# EAGLE design RH017.1 (EAGLE 7.1.0)
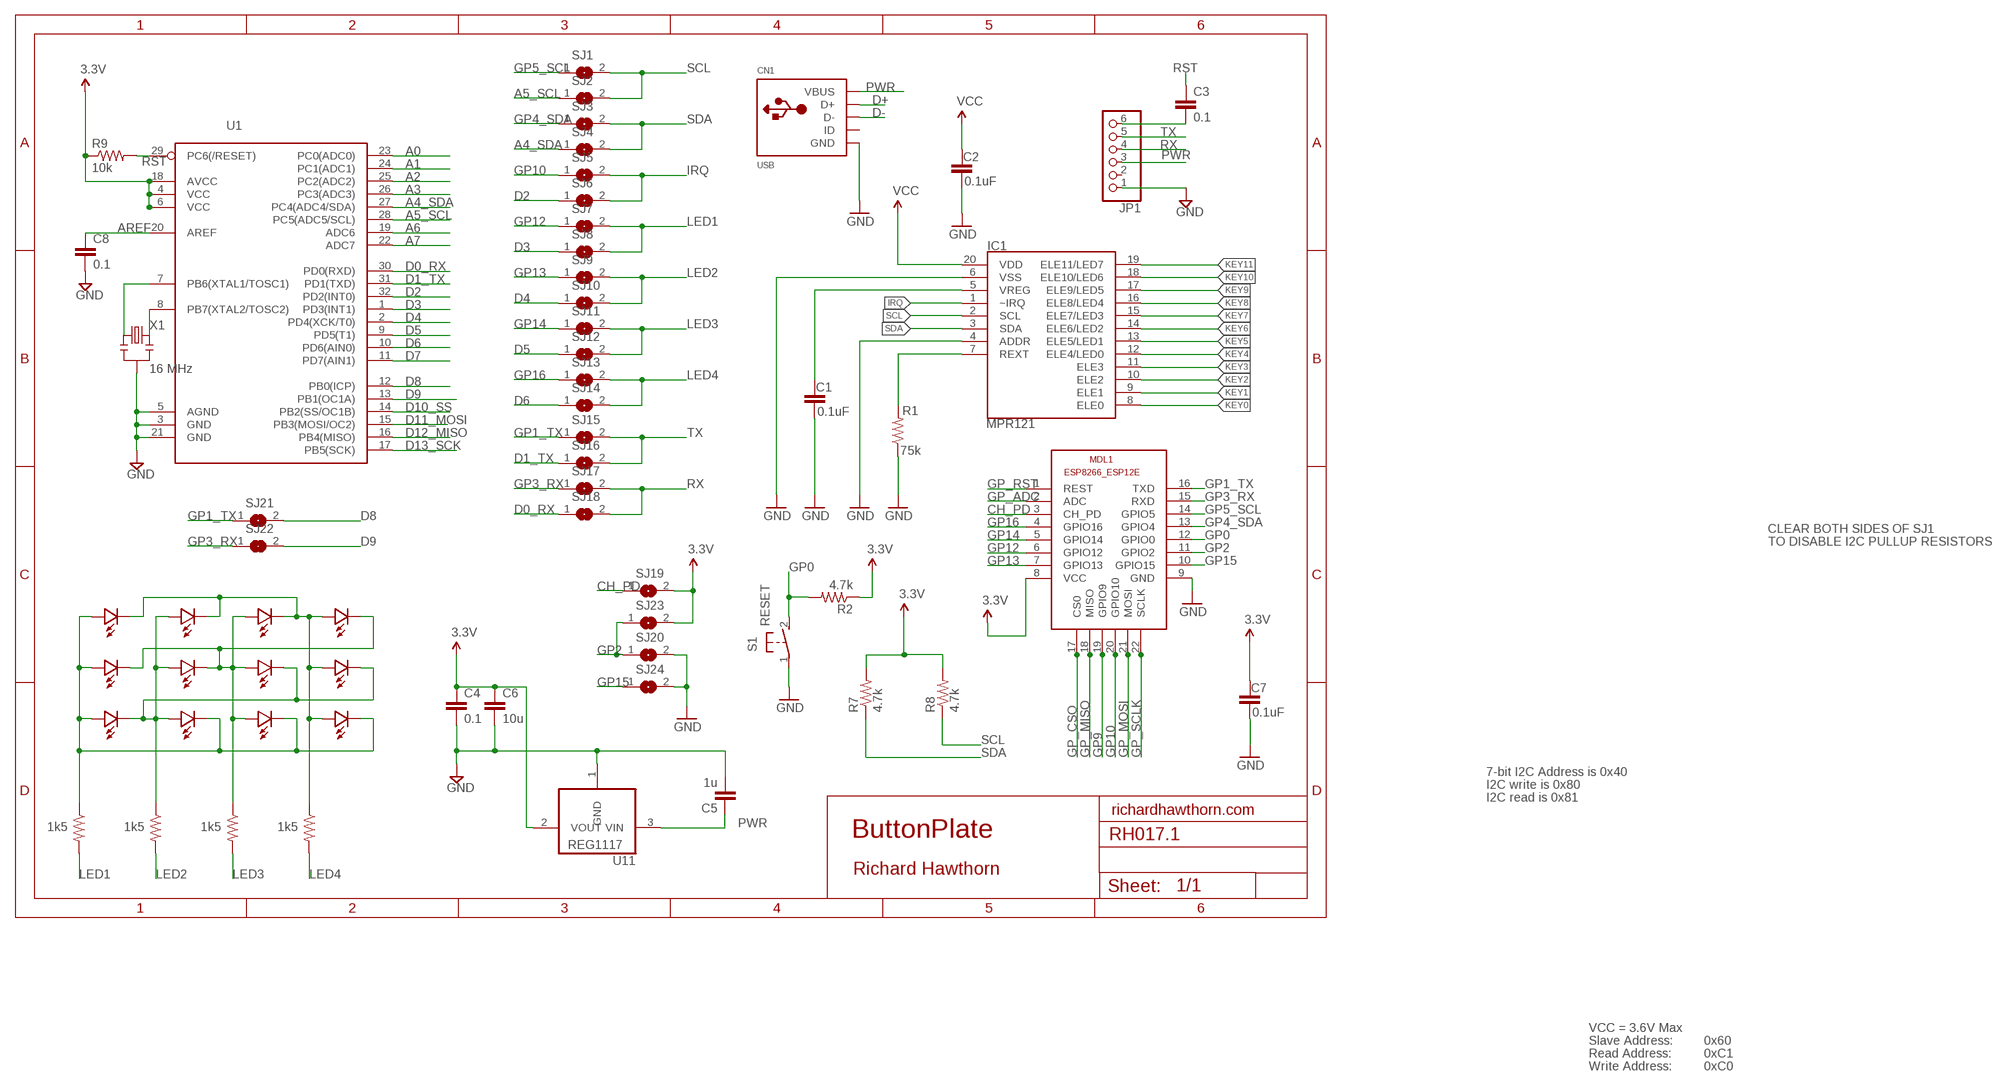
[diagram p0: schematic, sheet 1]

## Parts
C1  0.1uF  0.1UF-25V(+80/-20%)(0603)  [0603-CAP]
C2  0.1uF  0.1UF-25V(+80/-20%)(0603)  [0603-CAP]
C3  0.1  CAP0603-CAP  [0603-CAP]
C4  0.1  CAP0603-CAP  [0603-CAP]
C5  1u  CAP0603-CAP  [0603-CAP]
C6  10u  CAP0805-CAP  [0805-CAP]
C7  0.1uF  0.1UF-25V(+80/-20%)(0603)  [0603-CAP]
C8  0.1  CAP0603-CAP  [0603-CAP]
CN1  USB  USBMINIB  [USB-MINIB]
IC1  MPR121  MPR121V2  [QFN-20-0.4MM-V2]
JP1  PINHD-1X6  [1X06]
LED1  LED0603  [0603-LED]
LED2  LED0603  [0603-LED]
LED3  LED0603  [0603-LED]
LED4  LED0603  [0603-LED]
LED5  LED0603  [0603-LED]
LED6  LED0603  [0603-LED]
LED7  LED0603  [0603-LED]
LED8  LED0603  [0603-LED]
LED9  LED0603  [0603-LED]
LED10  LED0603  [0603-LED]
LED11  LED0603  [0603-LED]
LED12  LED0603  [0603-LED]
MDL1  ESP8266-12EESP8266-ESP12E  [ESP8266-ESP12E]
R1  75k  RESISTOR0603-RES  [0603-RES]
R2  4.7k  RESISTOR0805-RES  [0805]
R3  1k5  RESISTOR0603-RES  [0603-RES]
R4  1k5  RESISTOR0603-RES  [0603-RES]
R5  1k5  RESISTOR0603-RES  [0603-RES]
R6  1k5  RESISTOR0603-RES  [0603-RES]
R7  4.7k  RESISTOR0805-RES  [0805]
R8  4.7k  RESISTOR0805-RES  [0805]
R9  10k  RESISTOR0603-RES  [0603-RES]
S1  RESET  DTSM-3  [DTSM-3]
SJ1  SJ  [SJ]
SJ2  SJ  [SJ]
SJ3  SJ  [SJ]
SJ4  SJ  [SJ]
SJ5  SJ  [SJ]
SJ6  SJ  [SJ]
SJ7  SJ  [SJ]
SJ8  SJ  [SJ]
SJ9  SJ  [SJ]
SJ10  SJ  [SJ]
SJ11  SJ  [SJ]
SJ12  SJ  [SJ]
SJ13  SJ  [SJ]
SJ14  SJ  [SJ]
SJ15  SJ  [SJ]
SJ16  SJ  [SJ]
SJ17  SJ  [SJ]
SJ18  SJ  [SJ]
SJ19  SJ  [SJ]
SJ20  SJ  [SJ]
SJ21  SJ  [SJ]
SJ22  SJ  [SJ]
SJ23  SJ  [SJ]
SJ24  SJ  [SJ]
U1  ATMega-328  ATMEGA168/328TQFP32  [TQFP32-08]
U11  REG1117  [SOT223]
X1  16 MHz  RESONATORSMD  [RESONATOR-SMD]

## Nets
3.3V: C2.1 C4.1 C6.1 C7.1 IC1.20(VDD) MDL1.8(VCC) R2.1 R7.2 R8.2 R9.1 SJ19.2 SJ23.2 U1.4(VCC) U1.6(VCC) U1.18(AVCC) U11.2(VOUT) ; supply symbol labelled VCC
A0: U1.23(PC0(ADC0))
A1: U1.24(PC1(ADC1))
A2: U1.25(PC2(ADC2))
A3: U1.26(PC3(ADC3))
A4_SDA: SJ4.1 U1.27(PC4(ADC4/SDA))
A5_SCL: SJ2.1 U1.28(PC5(ADC5/SCL))
A6: U1.19(ADC6)
A7: U1.22(ADC7)
AREF: C8.1 U1.20(AREF)
CH_PD: MDL1.3(CH_PD) SJ19.1
D0_RX: SJ18.1 U1.30(PD0(RXD))
D1_TX: SJ16.1 U1.31(PD1(TXD))
D2: SJ6.1 U1.32(PD2(INT0))
D3: SJ8.1 U1.1(PD3(INT1))
D4: SJ10.1 U1.2(PD4(XCK/T0))
D5: SJ12.1 U1.9(PD5(T1))
D6: SJ14.1 U1.10(PD6(AIN0))
D7: U1.11(PD7(AIN1))
D8: SJ21.2 U1.12(PB0(ICP))
D9: SJ22.2 U1.13(PB1(OC1A))
D10_SS: U1.14(PB2(SS/OC1B))
D11_MOSI: U1.15(PB3(MOSI/OC2))
D12_MISO: U1.16(PB4(MISO))
D13_SCK: U1.17(PB5(SCK))
D+: CN1.D+
D-: CN1.D-
GND [power]: C1.2 C2.2 C4.2 C5.2 C6.2 C7.2 C8.2 CN1.GND IC1.4(ADDR) IC1.6(VSS) JP1.1 MDL1.9(GND) R1.1 S1.1 SJ20.2 SJ24.2 U1.3(GND) U1.5(AGND) U1.21(GND) U11.1(GND) X1.2
GP0: MDL1.12(GPIO0) R2.2 S1.2
GP1_TX: MDL1.16(TXD) SJ15.1 SJ21.1
GP2: MDL1.11(GPIO2) SJ20.1 SJ23.1
GP3_RX: MDL1.15(RXD) SJ17.1 SJ22.1
GP4_SDA: MDL1.13(GPIO4) SJ3.1
GP5_SCL: MDL1.14(GPIO5) SJ1.1
GP9: MDL1.19(GPIO9)
GP10: MDL1.20(GPIO10) SJ5.1
GP12: MDL1.6(GPIO12) SJ7.1
GP13: MDL1.7(GPIO13) SJ9.1
GP14: MDL1.5(GPIO14) SJ11.1
GP15: MDL1.10(GPIO15) SJ24.1
GP16: MDL1.4(GPIO16) SJ13.1
GP_ADC: MDL1.2(ADC)
GP_CSO: MDL1.17(CS0)
GP_MISO: MDL1.18(MISO)
GP_MOSI: MDL1.21(MOSI)
GP_RST: MDL1.1(REST)
GP_SCLK: MDL1.22(SCLK)
IRQ: IC1.1(~IRQ) SJ5.2 SJ6.2
KEY0: IC1.8(ELE0)
KEY1: IC1.9(ELE1)
KEY2: IC1.10(ELE2)
KEY3: IC1.11(ELE3)
KEY4: IC1.12(ELE4/LED0)
KEY5: IC1.13(ELE5/LED1)
KEY6: IC1.14(ELE6/LED2)
KEY7: IC1.15(ELE7/LED3)
KEY8: IC1.16(ELE8/LED4)
KEY9: IC1.17(ELE9/LED5)
KEY10: IC1.18(ELE10/LED6)
KEY11: IC1.19(ELE11/LED7)
LED1: R3.2 SJ7.2 SJ8.2
LED2: R4.2 SJ9.2 SJ10.2
LED3: R5.2 SJ11.2 SJ12.2
LED4: R6.2 SJ13.2 SJ14.2
N$3: U1.7(PB6(XTAL1/TOSC1)) X1.1
N$12: LED2.PLUS LED6.PLUS LED7.MINUS LED8.MINUS LED9.MINUS LED10.PLUS R4.1
N$20: C3.2 JP1.6
N$21: U1.8(PB7(XTAL2/TOSC2)) X1.3
N$22: LED1.PLUS LED5.PLUS LED9.PLUS LED10.MINUS LED11.MINUS LED12.MINUS R3.1
N$41: LED1.MINUS LED2.MINUS LED3.MINUS LED4.PLUS LED8.PLUS LED12.PLUS R6.1
N$50: LED3.PLUS LED4.MINUS LED5.MINUS LED6.MINUS LED7.PLUS LED11.PLUS R5.1
PWR [power]: C5.1 CN1.VBUS JP1.3 U11.3(VIN)
REXT: IC1.7(REXT) R1.2
RST: C3.1 R9.2 U1.29(PC6(/RESET))
RX: JP1.4 SJ17.2 SJ18.2
SCL: IC1.2(SCL) R8.1 SJ1.2 SJ2.2
SDA: IC1.3(SDA) R7.1 SJ3.2 SJ4.2
TX: JP1.5 SJ15.2 SJ16.2
VREG: C1.1 IC1.5(VREG)
Unconnected: CN1.ID JP1.2

## Notes on the sheet
- CLEAR BOTH SIDES OF SJ1
- TO DISABLE I2C PULLUP RESISTORS
- 7-bit I2C Address is 0x40
- I2C write is 0x80
- I2C read is 0x81
- richardhawthorn.com
- ButtonPlate
- Richard Hawthorn
- VCC = 3.6V Max
- Slave Address: | 0x60
- Read Address: | 0xC1
- Write Address: | 0xC0

## Library data of the parts
C1 C2 C7 = SparkFun-Capacitors:0.1UF-25V(+80/-20%)(0603): Ceramic Standard decoupling cap CAP-00810; PROD_ID: CAP-00810
C3-C6 C8 = LowPowerLab:CAP: Capacitor Standard 0603 ceramic capacitor, and 0.1" leaded capacitor.
CN1 = LowPowerLab:USB: USB Connectors USBMINIB - Surface Mount Female Mini-B USB Connector 4UConnector: 06564 By microbuilder.eu Thru-hole RA Female Mini-B USB Connector 4UConnector: 18732 By ladyada.net
IC1 = SparkFun-Sensors:MPR121: MPR121 Capacitive Touch Sensor Controller. Variant "V2" was created using an image import of the bottom of the IC. It matches metal to metal.
JP1 = Richards:PINHD-1X6: PIN HEADER
LED1-LED12 = LowPowerLab:LED
MDL1 = ESP8266-ESP12E:ESP8266-12E: ESP8266-12E with additional I/O and GPIO04/05 corrected The author cannot warrant that this library is free from error or will meet your specific requirements. Created by PuceBaboon.com. Komagane, Nagano, JAPAN
R1 R2 R7 R8 = SparkFun:RESISTOR: Resistor Basic schematic elements and footprints for 0603, 1206, and PTH resistors.
R3-R6 R9 = LowPowerLab:RESISTOR: Resistor Basic schematic elements and footprints for 0603, 1206, and PTH resistors.
S1 = switch-tact:DTSM-3
SJ1-SJ24 = jumper:SJ: SMD solder JUMPER
U1 = LowPowerLab:ATMEGA168/328: Atmel 32-pin 8-bit micro, 16k flash.
U11 = burr-brown:REG1117: 800mA and 1A Low Dropout (LDO) Positive Regulator 1.8V, 2.5V, 2.85V, 3.3V, 5V, and Adj; MPN: REG1117; OC_FARNELL: 1097566; OC_NEWARK: 14P6981
X1 = SparkFun:RESONATOR: Resonator Small SMD resonator. This is the itty bitty 10/20MHz resonators with built in caps. CSTCE10M0G55 and CSTCE20M0V53. Footprint has been reviewed closely but hasn't been tested yet.

## Net classes
1 power: width 0.381 mm, clearance 0.254 mm

## Board
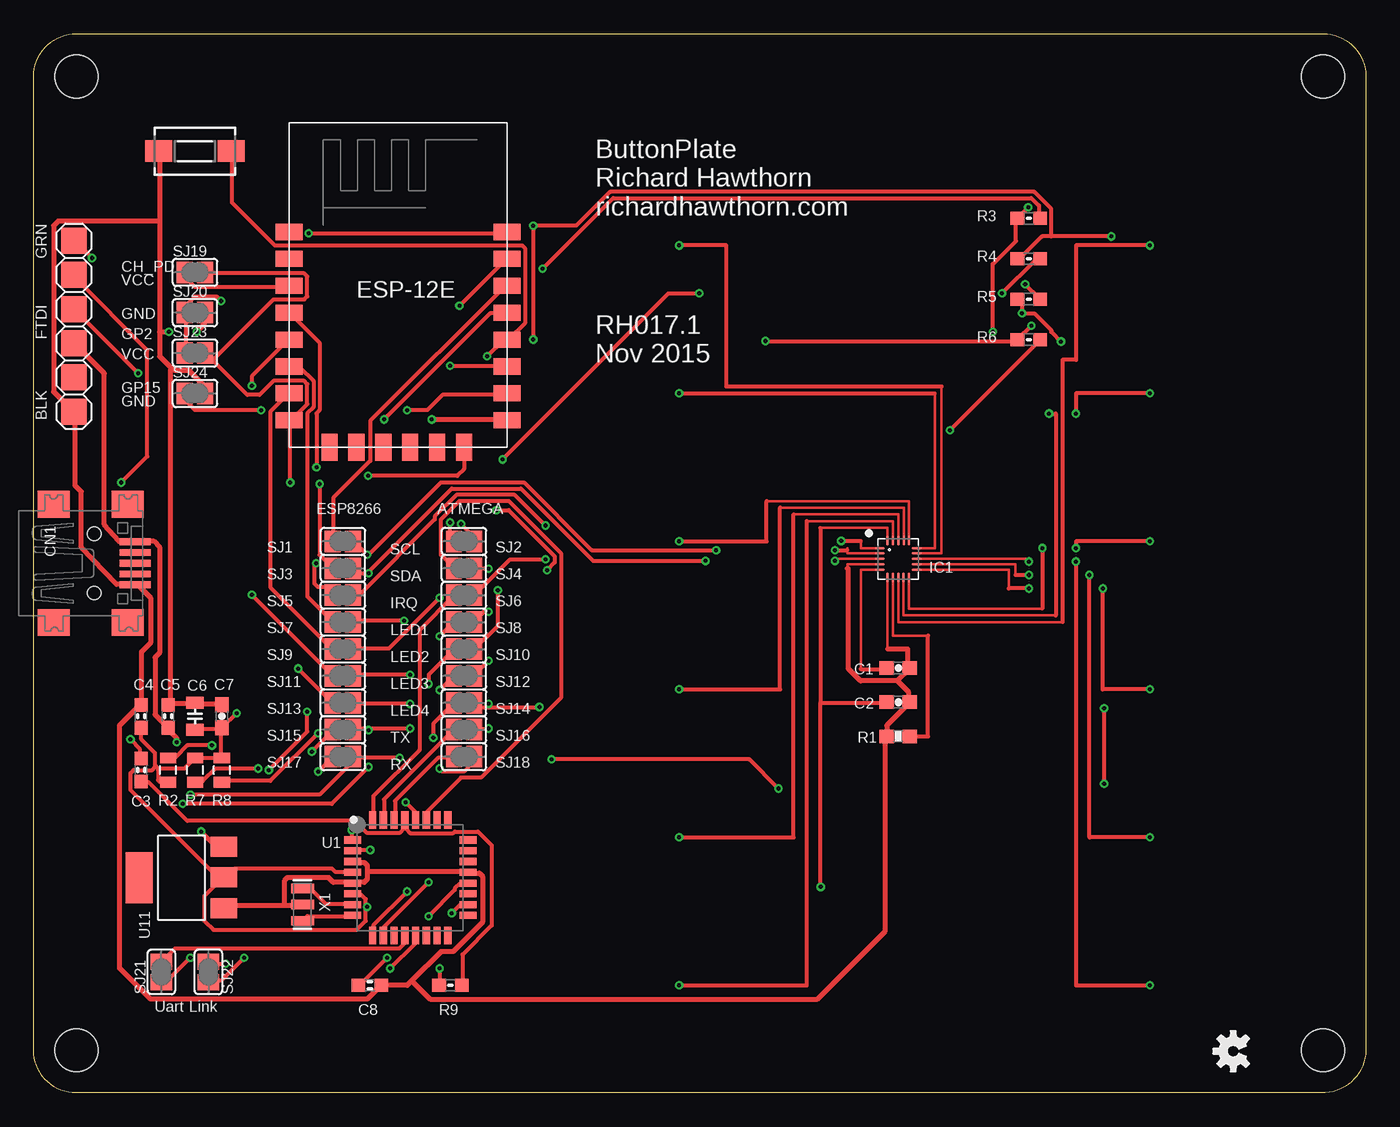
[diagram p1: board, top side]
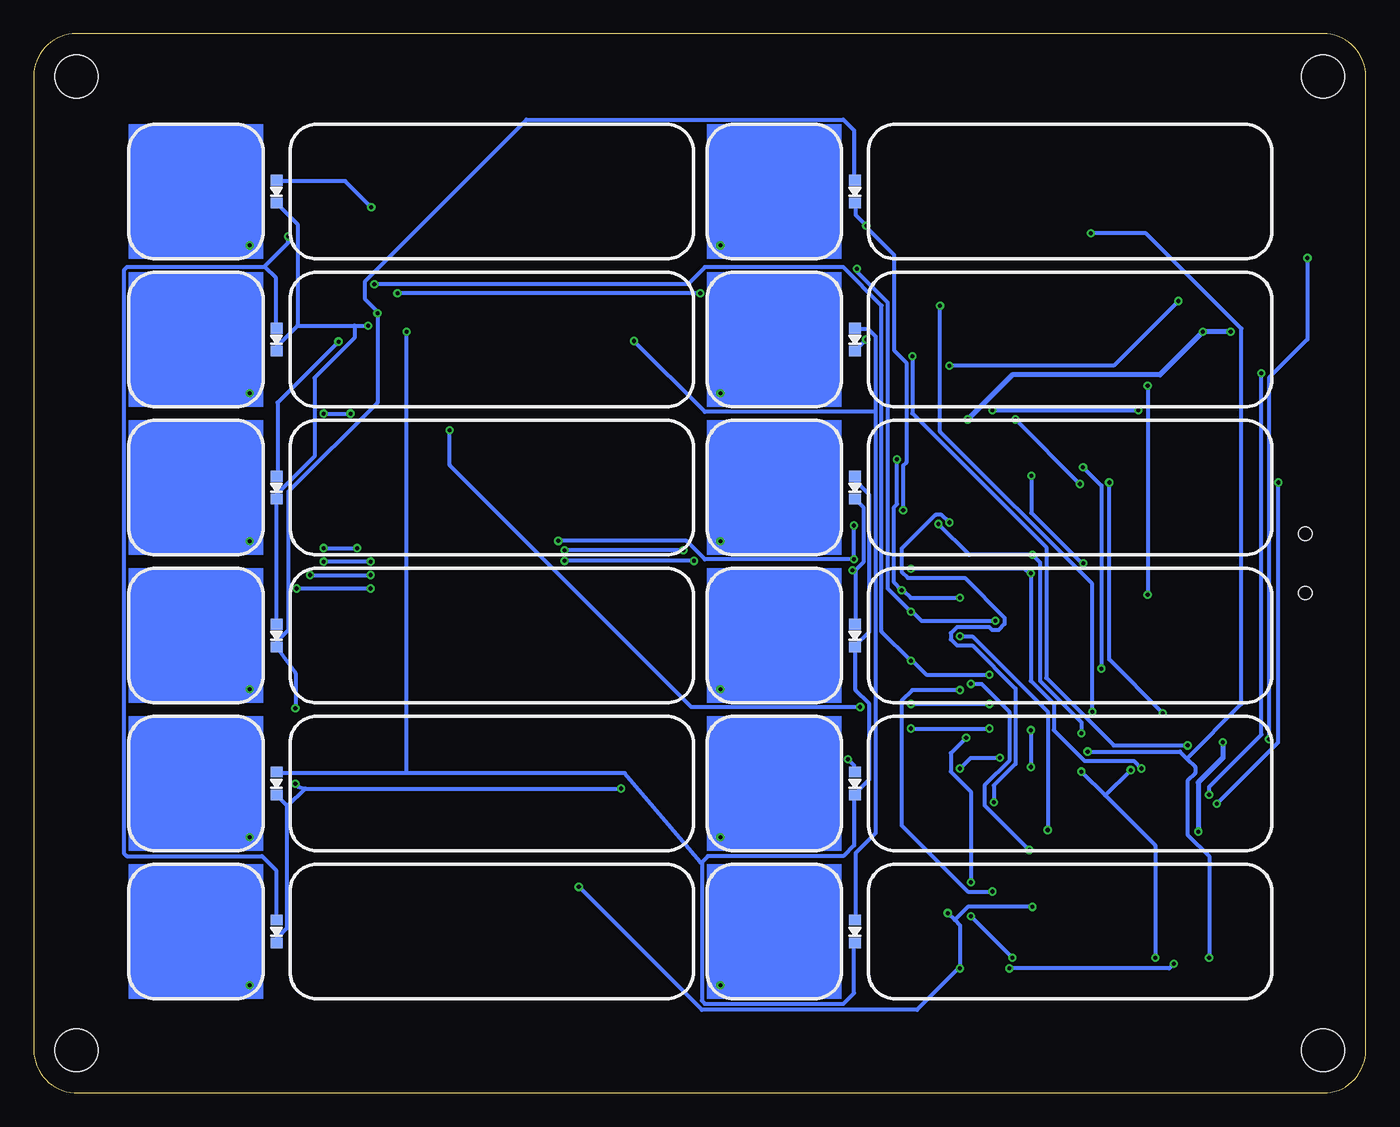
[diagram p2: board, bottom side, seen from below]

Size 99.06 x 78.74 mm. Coordinates in mm from the lower left corner, seen from the top.
Outline: 0,3.17 0,75.56 arc-90 3.17,78.74 95.89,78.74 arc-90 99.06,75.56 99.06,3.17 arc-90 95.76,0 3.17,0 arc-90 0,3.17
Copper layers (1*16): Top 0.035mm / dielectric 1.5mm / Bottom 0.035mm
Design rules "ITEADstudio_DRC *": minimum track width 12mil, minimum drill 12mil, track to track 6mil, track to pad 6mil, pad to pad 6mil, via to via 6mil, smd to smd 0mil, copper to edge 10mil, drill to drill 10mil, minimum pad ring 10mil, minimum via ring 6mil, stop-mask expansion 2mil, vias tented up to drill 100mil, thermal gap 15mil
Holes 3.2 mm at 3.17,3.17 95.89,3.17 3.17,75.56 95.89,75.56
tRestrict: area 17,65 to 37,79
bRestrict: area 17,65 to 37,79

### Footprints (pad centres in the part's own frame; a part is rotated, then mirrored left to right if it is on the bottom)
0603-CAP = smd 1.1 x 1: 1 -0.85,0; 2 0.85,0
0603-CAP' = smd 1.016 x 0.965: 1 -0.85,0; 2 0.85,0
0805-CAP = smd 0.902 x 1.3: 1 -1,0; 2 1,0
USB-MINIB = smd 0.5 x 2.308: D+ 0,4.064; D- -0.8,4.064; GND 1.6,4.064; ID 0.8,4.064; VBUS -1.6,4.064 | smd 2 x 2.4: GND1 -4.4,-2; GND2 -4.4,3.5; GND3 4.4,3.5; GND4 4.4,-2 | hole 1: -2.2,1; 2.2,1
QFN-20-0.4MM-V2 = smd 0.75 x 0.195: 1 -1.367,0.8; 2 -1.367,0.4; 3 -1.367,0; 4 -1.367,-0.4; 5 -1.367,-0.8; 11 1.375,-0.8; 12 1.375,-0.4; 13 1.375,0; 14 1.375,0.4; 15 1.375,0.8 | smd 0.195 x 0.75: 6 -0.795,-1.372; 7 -0.395,-1.372; 8 0.005,-1.372; 9 0.405,-1.372; 10 0.805,-1.372; 16 0.81,1.372; 17 0.41,1.372; 18 0.01,1.372; 19 -0.39,1.372; 20 -0.79,1.372
1X06 = smd 1.93 x 1.93: 1 -6.35,0; 2 -3.81,0; 3 -1.27,0; 4 1.27,0; 5 3.81,0; 6 6.35,0
0603-LED = smd 0.8 x 0.9: MINUS -0.85,0; PLUS 0.85,0
ESP8266-ESP12E = smd 2 x 1.2: 1 0,16; 2 0,14; 3 0,12; 4 0,10; 5 0,8; 6 0,6; 7 0,4; 8 0,2; 9 16.2,2; 10 16.2,4; 11 16.2,6; 12 16.2,8; 13 16.2,10; 14 16.2,12; 15 16.2,14; 16 16.2,16 | smd 1.2 x 2: 17 11,0; 18 3,0; 19 5,0; 20 13,0; 21 7,0; 22 9,0
0603-RES = smd 1.1 x 1: 1 -0.85,0; 2 0.85,0
0805 = smd 0.8 x 1.2: 1 -0.9,0; 2 0.9,0
0603-RES' = smd 1.016 x 0.965: 1 -0.85,0; 2 0.85,0
DTSM-3 = smd 2 x 1.6: 1 -2.7,0; 2 2.7,0
SJ = smd 1.168 x 1.6: 1 -0.762,0; 2 0.762,0
TQFP32-08 = smd 1.27 x 0.533: 1 -4.293,2.8; 2 -4.293,2; 3 -4.293,1.2; 4 -4.293,0.4; 5 -4.293,-0.4; 6 -4.293,-1.2; 7 -4.293,-2; 8 -4.293,-2.8; 17 4.293,-2.8; 18 4.293,-2; 19 4.293,-1.2; 20 4.293,-0.4; 21 4.293,0.4; 22 4.293,1.2; 23 4.293,2; 24 4.293,2.8 | smd 0.533 x 1.27: 9 -2.8,-4.293; 10 -2,-4.293; 11 -1.2,-4.293; 12 -0.4,-4.293; 13 0.4,-4.293; 14 1.2,-4.293; 15 2,-4.293; 16 2.8,-4.293; 25 2.8,4.293; 26 2,4.293; 27 1.2,4.293; 28 0.4,4.293; 29 -0.4,4.293; 30 -1.2,4.293; 31 -2,4.293; 32 -2.8,4.293
SOT223 = smd 1.499 x 2.007: 1 -2.261,-3.15; 2 0.025,-3.15; 3 2.311,-3.15 | smd 3.81 x 2.007: 4 0,3.15
RESONATOR-SMD = smd 0.7 x 1.7: 1 -1.2,0; 2 0,0; 3 1.2,0

### Placement (x,y rotation side)
C1  64.28,31.59 0 top
C2  64.28,29.05 0 top
C3  0.1  [0603-CAP']  8,24 90 top
C4  0.1  [0603-CAP']  8,28 90 top
C5  1u  [0603-CAP']  10,28 90 top
C6  12,28 90 top
C7  14,28 90 top
C8  0.1  [0603-CAP']  25,8 0 top
CN1  3.5,39.37 270 top
IC1  64.28,39.7 0 top
JP1  3,57 90 top
LED1  81,67 90 bottom
LED2  81,56 90 bottom
LED3  81,45 90 bottom
LED4  81,34 90 bottom
LED5  81,23 90 bottom
LED6  81,12 90 bottom
LED7  38,67 90 bottom
LED8  38,56 90 bottom
LED9  38,45 90 bottom
LED10  38,34 90 bottom
LED11  38,23 90 bottom
LED12  38,12 90 bottom
MDL1  19,48 0 top
R1  64.28,26.51 0 top
R2  10,24 90 top
R3  1k5  [0603-RES']  74,65 0 top
R4  1k5  [0603-RES']  74,62 0 top
R5  1k5  [0603-RES']  74,59 0 top
R6  1k5  [0603-RES']  74,56 0 top
R7  12,24 90 top
R8  14,24 90 top
R9  10k  [0603-RES']  31,8 0 top
S1  12,70 0 top
SJ1  23,41 0 top
SJ2  32,41 0 top
SJ3  23,39 0 top
SJ4  32,39 0 top
SJ5  23,37 0 top
SJ6  32,37 0 top
SJ7  23,35 0 top
SJ8  32,35 0 top
SJ9  23,33 0 top
SJ10  32,33 0 top
SJ11  23,31 0 top
SJ12  32,31 0 top
SJ13  23,29 0 top
SJ14  32,29 0 top
SJ15  23,27 0 top
SJ16  32,27 0 top
SJ17  23,25 0 top
SJ18  32,25 0 top
SJ19  12,61 0 top
SJ20  12,58 0 top
SJ21  9.5,9 90 top
SJ22  13,9 90 top
SJ23  12,55 0 top
SJ24  12,52 0 top
U1  28,16 0 top
U11  11,16 90 top
U$3  [OSHW-LOGO-S]  89.2,3.1 90 top
X1  20,14 270 top

### Tracks (layer width: path | path; a pad name or v marks a point on that pad's centre or on a via)
3.3V  (via drill 0.3)
  Top 0.2: IC1.20 63.5,42 58.5,42
  Top 0.305: 58.5,42 58.5,29 58.52,29 | 58.52,29 63.44,29 C2.1 | 13.32,54.46 15.89,51.89 16.8,51.89 17.83,52.92 20.12,52.92 20.34,52.69 20.34,51.21 19.09,49.95 MDL1.8 19.09,49.84 v19.09,45.38 | 13.32,54.46 12.8,54.98 SJ23.2 | 13.32,54.46 17.83,58.98 20.12,58.98 20.34,59.21 20.34,60.69 20.12,60.92 12.8,60.92 SJ19.2 | C7.1 13.95,27.09 12,27.09 C6.1 | 9.03,24.35 9.03,25.26 8,26.29 8,27.09 C4.1 | 9.26,24.12 9.03,24.35 | 9.26,24.12 11.2,24.12 11.89,24.8 R7.2 12.12,24.92 13.95,24.92 R8.2 13.95,25.03 13.95,26.98 C7.1 | v30.18,9.26 30.18,8 R9.1 | v31.09,13.37 31.66,13.95 32.23,13.95 U1.18 | 24.69,13.83 24.69,12.8 24,12.12 13.37,12.12 12.69,12.8 12.69,14.63 14.06,16 U11.2 | 24.69,13.83 24.69,14.4 24.35,14.74 23.77,14.74 U1.6 | U1.4 23.66,16.46 22.4,16.46 22.17,16.69 14.97,16.69 14.29,16 U11.2 | v24.8,13.83 24.69,13.83 | 9.03,24.35 9.03,24.23 8.8,24 7.43,24 7.2,23.77 7.2,22.52 13.83,15.89 U11.2 | v58.52,15.32 58.52,29 | v15.09,28.23 14.06,27.2 C7.1 | R2.1 10,23.12 9.38,23.12 9.25,23.25 9.25,24 9.26,24.12
  Bottom 0.305: v31.09,13.37 30.57,12.86 | 30.57,12.86 30.18,12.46 v30.18,9.26 30.29,9.26 33.38,6.17 49.38,6.17 v58.52,15.32 | 30.57,12.86 29.6,13.83 v24.8,13.83 | v19.09,45.38 19.09,32.23 v15.09,28.23
A4_SDA
  Top 0.305: U1.27 29.26,20.34 29.26,20.92 31.77,23.43 33.26,23.43 39.2,29.38 39.2,40.12 35.32,44.01 31.66,44.01 30.29,42.63 30.29,40.01 31.2,39.09 SJ4.1
A5_SCL  (via drill 0.3)
  Top 0.305: v27.66,21.6 28.35,20.92 28.35,20.34 U1.28 | v30.98,42.41 30.98,41.26 31.2,41.03 SJ2.1
  Bottom 0.305: v27.66,21.6 27.66,22.86 26.06,24.46 26.06,30.06 29.26,33.26 30.4,33.26 30.86,33.72 30.86,34.18 30.4,34.63 28,34.63 27.77,34.4 27.32,34.4 26.86,34.86 26.86,35.32 29.83,38.29 34.06,38.29 34.52,38.75 34.52,40.46 32,42.98 31.55,42.98 v30.98,42.41
AREF  (via drill 0.3)
  Top 0.305: v26.29,10.06 24.23,8 C8.1 | v29.38,13.14 31.32,15.09 31.32,15.2 31.66,15.54 32.23,15.54 U1.20
  Bottom 0.305: v29.38,13.14 v26.29,10.06
CH_PD
  Top 0.305: SJ19.1 11.32,60.92 11.32,60.58 12,59.89 18.97,59.89 MDL1.3
D0_RX
  Top 0.305: U1.30 26.86,20.34 26.86,21.72 30.06,24.92 31.2,24.92 SJ18.1
D1_TX
  Top 0.305: U1.31 26.06,20.34 26.06,21.83 31.2,26.98 SJ16.1
D2
  Top 0.305: U1.32 25.26,20.34 25.26,22.06 28.69,25.49 28.69,34.4 31.2,36.92 SJ6.1
D3  (via drill 0.3)
  Top 0.305: v23.66,19.55 23.66,18.86 U1.1 | v30.18,33.95 31.2,34.98 SJ8.1
  Bottom 0.305: v23.66,19.55 23.66,28.35 29.26,33.95 v30.18,33.95
D4  (via drill 0.3)
  Top 0.305: v25.03,18.06 23.77,18.06 U1.2 | v29.38,30.4 29.38,31.09 31.2,32.92 SJ10.1
  Bottom 0.305: v25.03,18.06 28.35,21.37 28.35,22.86 26.52,24.69 26.52,28.35 28.57,30.4 v29.38,30.4
D5  (via drill 0.3)
  Top 0.305: v27.77,14.97 25.26,12.46 25.26,11.77 U1.9 | v30.18,29.95 31.2,30.98 SJ12.1
  Bottom 0.305: v27.77,14.97 29.6,14.97 34.52,19.89 34.52,29.15 33.72,29.95 v30.18,29.95
D6  (via drill 0.3)
  Top 0.305: v29.38,15.66 26.06,12.34 26.06,11.77 U1.10 | v29.72,26.4 29.72,27.43 31.2,28.92 SJ14.1
  Bottom 0.305: v29.38,15.66 29.38,22.4 30.86,23.89 30.86,25.26 v29.72,26.4
D8
  Top 0.305: U1.12 27.55,11.66 27.55,11.09 27.2,10.74 10.52,10.74 9.6,9.83 SJ21.2
D9  (via drill 0.3)
  Top 0.305: v26.52,9.26 28.35,11.09 28.35,11.66 U1.13 | v14.29,9.6 13.14,9.6 13.03,9.72 SJ22.2
  Bottom 0.305: v26.52,9.26 14.63,9.26 v14.29,9.6
GND  (via drill 0.3)
  Top 0.2: IC1.4 60.5,39.3 60.5,39 | 63.49,33 IC1.6
  Top 0.381: 63.49,33 65,33 65,31.59 C1.2 65.15,31.55 64.24,30.63 | C7.2 13.95,28.92 12.12,28.92 C6.2 11.89,28.92 10.06,28.92 C5.2 10.17,29.03 10.17,53.72 10.29,53.84 | 10.29,53.84 9.37,54.75 9.37,56.58 | 10.29,53.84 10.4,53.72 11.54,53.72 12.69,52.58 12.69,52.01 SJ24.2 | 9.37,64.81 9.37,69.95 S1.1 | 9.37,64.81 9.37,56.58 | v12.12,56.58 12.69,57.15 12.69,57.95 SJ20.2 | 9.37,56.58 v10.06,56.58 | v29.6,50.06 35.09,50.06 MDL1.9 | 9.37,64.81 1.83,64.81 1.49,64.47 1.49,52.12 2.86,50.75 JP1.1 3.09,50.63 3.09,45.15 3.54,44.69 3.54,40.58 6.17,37.8 7.43,37.8 CN1.GND 7.66,37.83 8.69,36.8 8.69,33.45 8,32.76 8,28.92 C4.2 7.89,28.8 6.4,27.32 6.4,9.26 8.69,6.97 24.8,6.97 25.72,7.89 C8.2 25.95,8 27.77,8 28.12,8.34 | 64.24,30.63 61.49,30.63 60.58,31.55 60.58,38.98 60.5,39 | 64.24,30.63 65.04,29.83 65.04,29.15 C2.2 65.15,29.03 63.44,27.32 R1.1 63.32,26.4 63.32,12.03 58.26,6.97 29.49,6.97 28.12,8.34 | 18.63,13.95 14.29,13.95 14.17,13.83 U11.1 | 18.63,13.95 19.89,13.95 X1.2 | 24.8,16.46 24.8,16.92 24.57,17.14 23.77,17.14 U1.3 | 24.8,16.46 24.8,15.89 24.57,15.66 23.77,15.66 U1.5 23.55,15.66 22.29,15.66 21.95,16 18.86,16 18.63,15.77 18.63,13.95 | 28.12,8.34 30.29,10.52 31.2,10.52 33.38,12.69 33.38,16.12 33.15,16.34 32.35,16.34 U1.21 32.12,16.46 24.8,16.46
  Bottom 0.381: v10.06,56.58 v12.12,56.58 15.32,53.38 26.29,53.38 v29.6,50.06
GP0  (via drill 0.3)
  Top 0.305: v13.26,25.83 11.43,25.83 10.52,24.92 10.06,24.92 R2.2 | v33.72,54.75 34.86,55.89 35.09,55.89 MDL1.12 35.32,56.01 36.58,57.26 36.58,62.75 36.35,62.98 17.95,62.98 14.74,66.18 14.74,69.95 S1.2
  Bottom 0.305: v13.26,25.83 18.75,25.83 23.77,30.86 23.77,40.58 33.72,50.52 v33.72,54.75
GP1_TX  (via drill 0.3)
  Top 0.305: v11.66,10.06 9.94,8.34 9.6,8.34 SJ21.1 | v20.69,25.38 22.29,26.98 SJ15.1 | v20.46,63.89 35.09,63.89 MDL1.16
  Bottom 0.305: v11.66,10.06 11.66,17.6 13.26,19.2 13.26,23.2 12.69,23.77 12.69,24.23 13.32,24.86 | 13.32,24.86 13.83,25.38 v20.69,25.38 | v20.46,63.89 16.34,63.89 9.26,56.81 9.26,28.92 13.32,24.86
GP2  (via drill 0.3)
  Top 0.305: SJ23.1 11.32,55.09 11.32,57.95 SJ20.1 11.32,58.06 11.32,58.52 12,59.21 13.6,59.21 v13.95,58.86 | v30.98,54.06 35.09,54.06 MDL1.11
  Bottom 0.305: v30.98,54.06 18.75,54.06 v13.95,58.86
GP3_RX  (via drill 0.3)
  Top 0.305: v15.66,10.06 13.95,8.34 13.03,8.34 SJ22.1 | v21.14,23.89 22.17,24.92 SJ17.1 | v31.66,58.52 35.09,61.95 MDL1.15 | v20.34,28.35 20.34,26.86 v17.49,24
  Bottom 0.305: v15.66,10.06 15.66,18.4 19.37,22.12 | v21.14,23.89 19.37,22.12 | v31.66,58.52 31.66,49.15 20.34,37.83 v20.34,28.35 | 19.37,22.12 v17.49,24
GP4_SDA  (via drill 0.3)
  Top 0.305: v21.26,45.26 21.26,40.01 22.17,39.09 SJ3.1 | v26.06,50.06 33.95,57.95 35.09,57.95 MDL1.13
  Bottom 0.305: v26.06,50.06 v21.26,45.26
GP5_SCL
  Top 0.305: SJ1.1 22.29,41.03 22.29,44.23 25.03,46.98 25.03,49.95 35.09,60.01 MDL1.14
GP10  (via drill 0.3)
  Top 0.305: v21,39.38 20.88,39.38 20.88,37.88 21.12,37.62 22.25,37.62 SJ5.1 | v24.88,45.88 31.5,45.88 32,46.38 MDL1.20
  Bottom 0.305: v21,39.38 21.12,39.38 24.88,43.12 v24.88,45.88
GP12
  Top 0.305: SJ7.1 22.17,35.09 20.34,36.92 20.34,50.52 20.8,50.98 20.8,52.92 19.77,53.95 19.09,53.95 MDL1.6
GP13
  Top 0.305: SJ9.1 22.17,33.03 17.6,37.6 17.6,50.63 18.97,52.01 MDL1.7
GP14  (via drill 0.3)
  Top 0.305: v16.23,37.03 22.17,31.09 SJ11.1 | v16.23,52.58 16.23,53.26 18.97,56.01 MDL1.5
  Bottom 0.305: v16.23,52.58 v16.23,37.03
GP15  (via drill 0.3)
  Top 0.305: v16.92,50.75 12,50.75 11.32,51.44 11.32,51.89 SJ24.1 | v27.77,50.75 29.26,50.75 30.4,51.89 35.09,51.89 MDL1.10
  Bottom 0.305: v27.77,50.75 v16.92,50.75
GP16  (via drill 0.3)
  Top 0.305: v19.66,31.55 22.17,29.03 SJ13.1 | v21.03,46.52 21.03,50.52 21.26,50.75 21.26,55.78 19.09,57.95 MDL1.4
  Bottom 0.305: v19.66,31.55 19.66,45.15 v21.03,46.52
IRQ  (via drill 0.3)
  Top 0.2: IC1.1 61.5,40.5 61.5,41
  Top 0.305: v60.05,41.03 61.49,41.03 61.5,41 | v38.06,39.66 35.43,39.66 32.8,37.03 SJ6.2 | v38.06,42.18 35.78,44.46 31.43,44.46 29.83,42.86 29.83,42.63 24.23,37.03 23.77,37.03 SJ5.2
  Bottom 0.305: v60.05,41.03 50.52,41.03 49.15,39.66 v38.06,39.66 v38.06,42.18
KEY0  (via drill 0.31)
  Top 0.2: 76.5,35 64.29,35 IC1.8
  Top 0.305: v83,63 77.5,63 77.5,54.5 76.5,54.5 76.5,35
KEY1  (via drill 0.31)
  Top 0.2: 76,35.5 64.69,35.5 IC1.9
  Top 0.305: v83,52 77.5,52 v77.5,50.5 | v75.5,50.5 76,50.5 76,35.5
  Bottom 0.305: v77.5,50.5 v75.5,50.5
KEY2  (via drill 0.31)
  Top 0.2: 75,36 65.09,36 IC1.10
  Top 0.305: v83,41 77.5,41 v77.5,40.5 | v75,40.5 75,36
  Bottom 0.305: v77.5,40.5 v75,40.5
KEY3  (via drill 0.31)
  Top 0.2: IC1.11 72.5,38.9 72.5,37.5
  Top 0.305: v83,30 79.5,30 v79.5,37.5 | v74,37.5 72.5,37.5
  Bottom 0.305: v79.5,37.5 v74,37.5
KEY4  (via drill 0.31)
  Top 0.2: IC1.12 73,39.3 73,38.5
  Top 0.305: v83,19 78.5,19 v78.5,38.5 | v74,38.5 73,38.5
  Bottom 0.305: v78.5,38.5 v74,38.5
KEY5  (via drill 0.31)
  Top 0.2: IC1.13 74,39.7 v74,39.5
  Top 0.305: v77.5,39.5 77.5,8 v83,8
  Bottom 0.305: v74,39.5 v77.5,39.5
KEY6  (via drill 0.31)
  Top 0.2: IC1.14 67.5,40.1 67.5,52.5
  Top 0.305: 67.5,52.5 51.5,52.5 51.5,63 v48,63
KEY7  (via drill 0.31)
  Top 0.2: 67,52 67,40.5 IC1.15
  Top 0.305: v48,52 67,52
KEY8  (via drill 0.31)
  Top 0.2: 54.5,44 65.09,44 IC1.16
  Top 0.305: v48,41 54.5,41 54.5,44
KEY9  (via drill 0.31)
  Top 0.2: 55.5,43.5 64.69,43.5 IC1.17
  Top 0.305: v48,30 55.5,30 55.5,43.5
KEY10  (via drill 0.31)
  Top 0.2: 56.5,43 64.3,43 IC1.18
  Top 0.305: v48,19 56.5,19 56.5,43
KEY11  (via drill 0.31)
  Top 0.2: 57.5,42.5 63.9,42.5 IC1.19
  Top 0.305: v48,8 57.5,8 57.5,42.5
LED1  (via drill 0.3)
  Top 0.305: v37.83,61.27 43.09,66.52 74.18,66.52 74.75,65.95 74.75,65.04 R3.2 | v33.83,35.78 33.49,35.78 32.8,35.09 SJ8.2 | v27.55,35.09 23.77,35.09 SJ7.2
  Bottom 0.305: v37.83,61.27 37.83,61.04 35.55,58.75 35.55,37.49 v33.83,35.78 33.72,35.78 33.03,35.09 v27.55,35.09
LED2  (via drill 0.3)
  Top 0.305: v72.01,59.44 74.52,61.95 74.75,61.95 R4.2 | v49.49,59.44 47.21,59.44 v34.86,47.09 | v34.52,37.38 34.52,34.75 32.8,33.03 SJ10.2 | v30.18,36.8 26.4,33.03 23.77,33.03 SJ9.2
  Bottom 0.305: v49.49,59.44 v72.01,59.44 | v34.86,47.09 34.86,43.78 35.09,43.55 35.09,37.95 v34.52,37.38 34.4,37.38 33.83,36.8 v30.18,36.8
LED3  (via drill 0.3)
  Top 0.305: v73.72,60.12 74.75,59.09 R5.2 | v33.83,32.12 32.8,31.09 SJ12.2 | v28,31.09 23.77,31.09 SJ11.2
  Bottom 0.305: v73.72,60.12 50.41,60.12 49.15,61.38 38.86,61.38 36.01,58.52 36.01,34.29 v33.83,32.12 33.72,32.12 32.69,31.09 v28,31.09
LED4  (via drill 0.3)
  Top 0.305: v68.12,49.26 74.75,55.89 R6.2 | 33.83,28.69 33.03,28.69 32.8,28.92 SJ14.2 | 33.83,28.69 v37.6,28.69 | v28,28.92 23.77,28.92 SJ13.2 | v33.83,28.92 33.83,28.69
  Bottom 0.305: v68.12,49.26 68.12,46.66 50.15,28.69 v37.6,28.69 | v33.83,28.92 v28,28.92
N$3
  Top 0.305: U1.7 23.66,14.06 21.72,14.06 20.69,15.09 20,15.09 X1.1
N$12  (via drill 0.3)
  Top 0.305: v37.15,56.01 v37.15,64.47 40.35,64.47 42.86,66.98 74.41,66.98 75.67,65.72 75.67,63.66 | v38.18,38.86 38.75,39.43 38.75,39.89 35.32,43.32 v34.4,43.32 | v80.12,63.66 75.67,63.66 | 75.67,63.66 74.98,63.66 73.38,62.06 73.15,62.06 R4.1
  Bottom 0.305: 37.95,38.86 37.95,34.86 LED10.PLUS | 37.95,38.86 37.38,39.43 37.38,43.55 37.95,44.12 LED9.MINUS | v37.15,56.01 37.95,55.21 LED8.MINUS | LED7.MINUS 37.95,66.06 37.95,65.27 v37.15,64.47 37.15,64.35 35.09,62.29 35.09,55.21 34.18,54.29 34.18,46.86 34.4,46.63 v34.4,43.32 | v38.18,38.86 37.95,38.86 | 81.84,61.38 92.13,61.38 92.35,61.15 92.35,17.83 92.13,17.6 82.07,17.6 81.04,16.57 81.04,12.92 LED6.PLUS | 81.84,61.38 81.04,60.58 81.04,56.92 LED2.PLUS | v80.12,63.66 80.12,63.21 81.84,61.49 81.84,61.38
N$20  (via drill 0.3)
  Top 0.305: v7.2,26.29 7.89,25.6 7.89,24.92 C3.2 | v4.34,62.06 3.09,63.32 JP1.6
  Bottom 0.305: v7.2,26.29 7.2,53.15 4.34,56.01 v4.34,62.06
N$21
  Top 0.305: U1.8 23.66,13.14 20.34,13.14 X1.3
N$22  (via drill 0.3)
  Top 0.305: v73.95,65.84 73.15,65.04 R3.1 73.04,64.92 73.04,63.32 71.32,61.61 v71.32,56.58
  Bottom 0.305: v73.95,65.84 75.89,67.78 80.92,67.78 LED1.PLUS | 49.38,17.14 49.38,6.86 49.15,6.63 38.86,6.63 38.06,7.43 38.06,11.09 LED12.MINUS | 49.38,17.14 48.92,17.6 38.86,17.6 38.06,18.4 38.06,22.06 LED11.MINUS 37.95,22.29 36.92,23.32 36.92,28.92 37.95,29.95 37.95,33.15 LED10.MINUS 37.95,33.26 36.92,34.29 36.92,44.46 37.95,45.49 37.95,45.83 LED9.PLUS | 71.32,23.77 55.12,23.77 49.49,17.14 49.38,17.14 | 71.32,23.77 80.92,23.77 LED5.PLUS | 71.32,23.77 v71.32,56.58
N$41  (via drill 0.3)
  Top 0.305: v74.18,57.04 R6.1 73.04,55.89 v54.41,55.89
  Bottom 0.305: LED4.PLUS 81.04,34.86 81.04,44.12 LED3.MINUS 80.92,44.23 80.92,44.58 78.18,47.32 78.18,53.15 75.21,56.12 75.21,57.04 | 79.44,57.04 80.92,55.55 80.92,55.21 LED2.MINUS | 79.44,57.04 79.44,64.58 80.92,66.06 LED1.MINUS | 79.44,57.04 75.21,57.04 | 75.21,57.04 v74.18,57.04 | 36.46,50.63 36.46,56.24 37.03,56.81 37.95,56.81 LED8.PLUS | 36.46,50.63 36.46,19.32 37.95,17.83 37.95,12.92 LED12.PLUS | v54.41,55.89 49.15,50.63 36.46,50.63
N$50  (via drill 0.3)
  Top 0.305: v38.52,24.8 53.22,24.8 v55.39,22.63 | R5.1 73.15,58.98 73.5,58.64 v73.5,57.95 74.41,57.95 75.67,56.69 75.67,56.58 v76.39,55.85 | v79.6,28.6 v79.6,22.97
  Bottom 0.305: 80.24,21.37 80.24,12.23 80.92,11.54 80.92,11.2 LED6.MINUS | 80.24,21.37 80.92,22.06 LED5.MINUS | v38.52,24.8 38.06,24.35 38.06,23.89 LED11.PLUS | 78.87,22.63 v55.39,22.63 | 78.87,22.63 80.12,21.37 80.24,21.37 | v76.39,55.85 80.92,51.32 80.92,45.95 LED3.PLUS | LED7.PLUS 38.06,67.89 38.06,71.55 38.86,72.35 62.41,72.35 74.41,60.35 74.41,58.98 73.5,58.06 v73.5,57.95 73.5,51.32 80.12,44.69 80.12,34.4 80.92,33.6 80.92,33.26 LED4.MINUS 80.92,33.03 79.6,31.2 v79.6,28.6 | v79.6,22.97 79.37,22.75 78.87,22.63
PWR  (via drill 0.3)
  Top 0.381: JP1.3 3.09,55.66 5.26,53.49 5.26,42.25 6.36,41 7.43,41 CN1.VBUS 7.66,41.03 8.91,41.03 9.37,40.58 9.37,32.72 9.03,32.38 9.03,28.12 9.94,27.2 C5.1 10.06,26.98 10.63,26.4 v10.63,26.06 | v12.46,19.43 13.49,18.4 14.06,18.4 U11.3
  Bottom 0.381: v12.46,19.43 12.46,23.09 10.63,24.92 v10.63,26.06
REXT
  Top 0.2: 66.5,34 63.89,34 IC1.7
  Top 0.305: R1.2 66.5,26.51 66.5,34
RST
  Top 0.305: R9.2 31.89,8 31.89,10.29 34.06,12.46 34.06,18.4 33.03,19.43 31.32,19.43 31.2,19.32 28,19.32 27.66,19.66 27.66,20.23 U1.29 27.55,19.66 27.2,19.32 24.8,19.32 23.89,20.23 11.43,20.23 8.57,23.09 8,23.09 C3.1
RX  (via drill 0.3)
  Top 0.305: v27.2,24.92 23.77,24.92 SJ17.2 23.89,24.8 21.26,22.17 v11.66,22.17 | v30.18,24.12 30.4,23.89 32,23.89 32.69,24.57 32.69,24.92 SJ18.2 | v7.77,53.49 3.09,58.18 JP1.4
  Bottom 0.305: v27.2,24.92 29.38,24.92 v30.18,24.12 | v7.77,53.49 7.77,26.63 11.66,22.75 v11.66,22.17
SCL  (via drill 0.3)
  Top 0.2: IC1.2 60.5,40.1 60.5,40.35 60.5,40.5
  Top 0.305: v21.14,26.75 17.6,23.2 14.06,23.2 R8.1 | SJ1.2 23.77,41.03 v24.8,40.01 24.92,40.01 30.29,45.38 36.46,45.38 41.49,40.35 v50.75,40.35 | v59.59,40.35 60.5,40.35 | v31.77,42.29 32.69,41.38 32.69,41.03 SJ2.2
  Bottom 0.305: v21.14,26.75 21.14,27.55 24.23,30.63 24.23,39.43 v24.8,40.01 29.49,40.01 v31.77,42.29 | v50.75,40.35 v59.59,40.35
SDA  (via drill 0.3)
  Top 0.2: IC1.3 59.5,39.7 59.5,39.55 59.5,39.5
  Top 0.305: v16.69,24.12 13.49,24.12 12.57,23.2 12,23.2 R7.1 | SJ3.2 23.77,38.98 24.12,38.63 v24.92,38.63 24.92,38.75 31.09,44.92 36.23,44.92 41.6,39.55 v49.95,39.55 | v33.83,38.98 32.8,38.98 SJ4.2 | v59.59,39.55 59.5,39.55
  Bottom 0.305: v16.69,24.12 17.26,24.69 20.92,24.69 23.2,26.98 23.2,28.92 24.92,30.63 v24.92,38.63 25.03,38.63 25.38,38.98 v33.83,38.98 | v49.95,39.55 v59.59,39.55
TX  (via drill 0.3)
  Top 0.305: v28,27.09 24.92,27.09 | 24.92,27.09 23.77,27.09 SJ15.2 | v33.83,27.09 32.8,27.09 SJ16.2 | v6.51,45.38 8.46,47.32 8.46,55.21 3.09,60.58 3.09,60.81 JP1.5 | v11.09,21.49 22.17,21.49 v24.92,24.23 | v24.92,26.98 24.92,27.09
  Bottom 0.305: v33.83,27.09 v28,27.09 | v6.51,45.38 6.51,26.06 v11.09,21.49 | v24.92,26.98 v24.92,24.23
VREG
  Top 0.2: IC1.5 61.5,38.9 61.5,31.5
  Top 0.305: 61.5,31.5 63.44,31.5 C1.1
(copper drawn outside any net)
  shapes: Bottom area x12

### Text on the board
tNames: ButtonPlate / Richard Hawthorn / richardhawthorn.com | GRN | CH_PD | VCC | GND | FTDI | GP2 | VCC | RH017.1 / Nov 2015 | GP15 | GND | BLK | ESP8266 | ATMEGA | SCL | SDA | IRQ | LED1 | LED2 | LED3 | LED4 | TX | RX | Uart Link
tDocu: REG